# Altium schematic sheet Power_Board.SchDoc
size A4
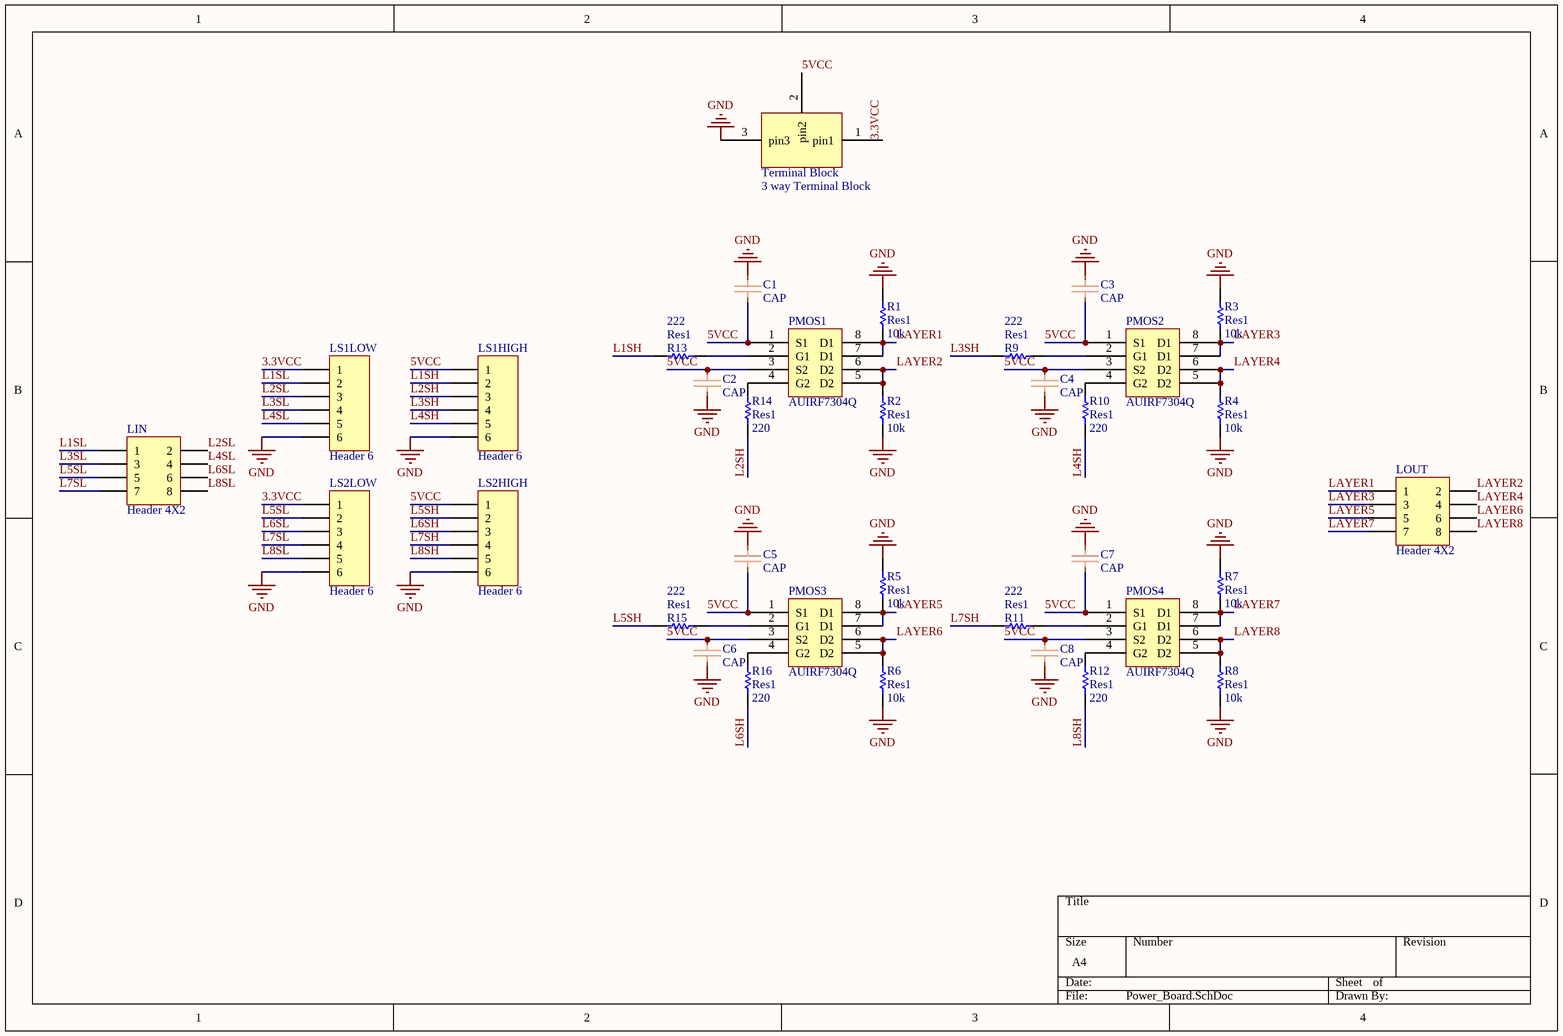
[diagram p0: Power_Board.SchDoc]

## Parts
C1  CAP  [RAD0.2A]
C2  CAP  [RAD0.2A]
C3  CAP  [RAD0.2A]
C4  CAP  [RAD0.2A]
C5  CAP  [RAD0.2A]
C6  CAP  [RAD0.2A]
C7  CAP  [RAD0.2A]
C8  CAP  [RAD0.2A]
LIN  Header 4X2  [HDR2X4]
LOUT  Header 4X2  [HDR2X4]
LS1HIGH  Header 6  [HDR1X6]
LS1LOW  Header 6  [HDR1X6]
LS2HIGH  Header 6  [HDR1X6]
LS2LOW  Header 6  [HDR1X6]
PMOS1  AUIRF7304Q  [AUIRF7304Q]
PMOS2  AUIRF7304Q  [AUIRF7304Q]
PMOS3  AUIRF7304Q  [AUIRF7304Q]
PMOS4  AUIRF7304Q  [AUIRF7304Q]
R1  Res1  value 10k  [AXIAL0.4]
R2  Res1  value 10k  [AXIAL0.4]
R3  Res1  value 10k  [AXIAL0.4]
R4  Res1  value 10k  [AXIAL0.4]
R5  Res1  value 10k  [AXIAL0.4]
R6  Res1  value 10k  [AXIAL0.4]
R7  Res1  value 10k  [AXIAL0.4]
R8  Res1  value 10k  [AXIAL0.4]
R9  Res1  value 222  [AXIAL0.4]
R10  Res1  value 220  [AXIAL0.4]
R11  Res1  value 222  [AXIAL0.4]
R12  Res1  value 220  [AXIAL0.4]
R13  Res1  value 222  [AXIAL0.4]
R14  Res1  value 220  [AXIAL0.4]
R15  Res1  value 222  [AXIAL0.4]
R16  Res1  value 220  [AXIAL0.4]
Terminal_Block  3 way Terminal Block  [PCTB3N]

## Nets
GND: C1.1(N/A) C2.2(N/A) C3.1(N/A) C4.2(N/A) C5.1(N/A) C6.2(N/A) C7.1(N/A) C8.2(N/A) LS1HIGH.6 LS1LOW.6 LS2HIGH.6 LS2LOW.6 R1.1 R2.2 R3.1 R4.2 R5.1 R6.2 R7.1 R8.2 Terminal_Block.3(pin3)
3.3VCC: LS1LOW.1 LS2LOW.1 Terminal_Block.1(pin1)
5VCC: C1.2(N/A) C2.1(N/A) C3.2(N/A) C4.1(N/A) C5.2(N/A) C6.1(N/A) C7.2(N/A) C8.1(N/A) LS1HIGH.1 LS2HIGH.1 PMOS1.1(S1) PMOS1.3(S2) PMOS2.1(S1) PMOS2.3(S2) PMOS3.1(S1) PMOS3.3(S2) PMOS4.1(S1) PMOS4.3(S2) Terminal_Block.2(pin2)
L1SH: LS1HIGH.2 R13.1
L1SL: LIN.1 LS1LOW.2
L2SH: LS1HIGH.3 R14.1
L2SL: LIN.2 LS1LOW.3
L3SH: LS1HIGH.4 R9.1
L3SL: LIN.3 LS1LOW.4
L4SH: LS1HIGH.5 R10.1
L4SL: LIN.4 LS1LOW.5
L5SH: LS2HIGH.2 R15.1
L5SL: LIN.5 LS2LOW.2
L6SH: LS2HIGH.3 R16.1
L6SL: LIN.6 LS2LOW.3
L7SH: LS2HIGH.4 R11.1
L7SL: LIN.7 LS2LOW.4
L8SH: LS2HIGH.5 R12.1
L8SL: LIN.8 LS2LOW.5
LAYER1: LOUT.1 PMOS1.7(D1) PMOS1.8(D1) R1.2
LAYER2: LOUT.2 PMOS1.5(D2) PMOS1.6(D2) R2.1
LAYER3: LOUT.3 PMOS2.7(D1) PMOS2.8(D1) R3.2
LAYER4: LOUT.4 PMOS2.5(D2) PMOS2.6(D2) R4.1
LAYER5: LOUT.5 PMOS3.7(D1) PMOS3.8(D1) R5.2
LAYER6: LOUT.6 PMOS3.5(D2) PMOS3.6(D2) R6.1
LAYER7: LOUT.7 PMOS4.7(D1) PMOS4.8(D1) R7.2
LAYER8: LOUT.8 PMOS4.5(D2) PMOS4.6(D2) R8.1
NetPMOS1_2: PMOS1.2(G1) R13.2
NetPMOS1_4: PMOS1.4(G2) R14.2
NetPMOS2_2: PMOS2.2(G1) R9.2
NetPMOS2_4: PMOS2.4(G2) R10.2
NetPMOS3_2: PMOS3.2(G1) R15.2
NetPMOS3_4: PMOS3.4(G2) R16.2
NetPMOS4_2: PMOS4.2(G1) R11.2
NetPMOS4_4: PMOS4.4(G2) R12.2

## Library data of the parts
C1-C8 = CAP: Capacitor
LIN LOUT = Header 4X2: Header, 4-Pin, Dual row; LatestRevisionDate: 17-Jul-2002; LatestRevisionNote: Re-released for DXP Platform.; Publisher: Altium Limited
LS1HIGH LS1LOW LS2HIGH LS2LOW = Header 6: Header, 6-Pin; LatestRevisionDate: 17-Jul-2002; LatestRevisionNote: Re-released for DXP Platform.; Publisher: Altium Limited
PMOS1-PMOS4 Terminal_Block = Component_1
R1-R16 = Res1: Resistor; Published: 8-Jun-2000; LatestRevisionDate: 17-Jul-2002; LatestRevisionNote: Re-released for DXP Platform.; PackageReference: AXIAL-0.3; Publisher: Altium Limited; PackageDescription: Axial Device, Thru-Hole; 2 Leads; 0.3 in Pin Spacing